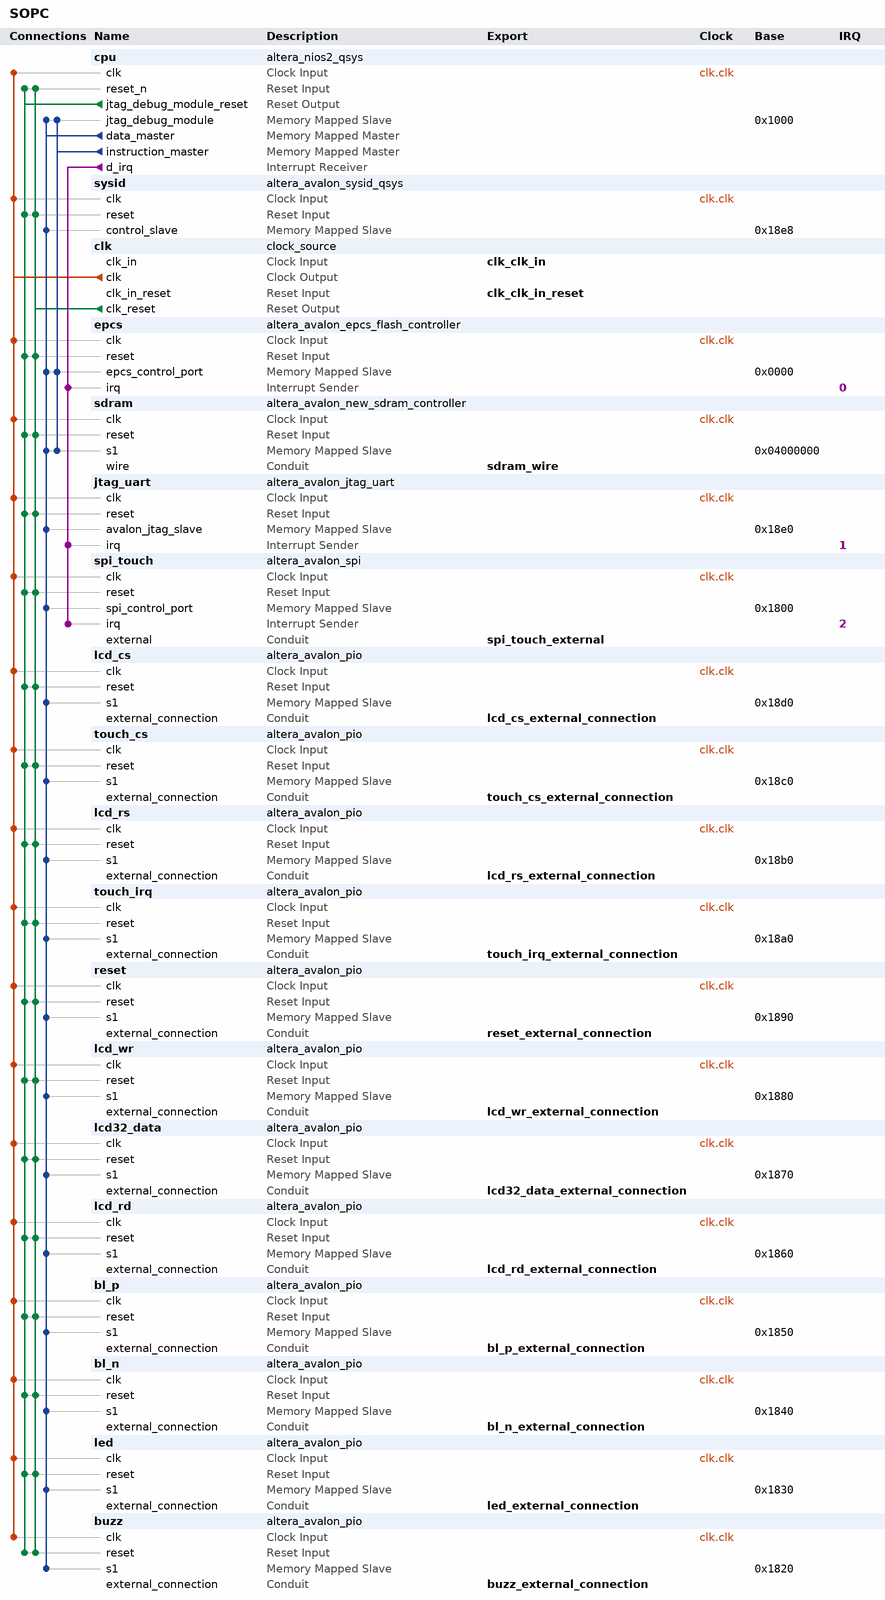
[diagram p0: system contents]
# Platform Designer (Qsys) system SOPC, Cyclone II EP2C5T144C8
# Parameters at their usual value, and those the tool derives, are not listed.
package require -exact qsys 13.0.1.99.2
create_system SOPC
set_project_property DEVICE_FAMILY {Cyclone II}
set_project_property DEVICE EP2C5T144C8

add_instance cpu altera_nios2_qsys 13.0
set_instance_parameter_value cpu manuallyAssignCpuID false
set_instance_parameter_value cpu resetSlave epcs.epcs_control_port
set_instance_parameter_value cpu exceptionSlave sdram.s1
set_instance_parameter_value cpu breakSlave cpu.jtag_debug_module
set_instance_parameter_value cpu impl Fast
set_instance_parameter_value cpu icache_size 2048
set_instance_parameter_value cpu dcache_size 0

add_instance sysid altera_avalon_sysid_qsys 13.0
set_instance_parameter_value sysid id 0

add_instance clk clock_source 13.0
set_instance_parameter_value clk clockFrequency 50000000

add_instance epcs altera_avalon_epcs_flash_controller 13.0.1.99.2
set_instance_parameter_value epcs useASMIAtom true

add_instance sdram altera_avalon_new_sdram_controller 13.0.1.99.2
set_instance_parameter_value sdram TAC 5.5
set_instance_parameter_value sdram TRCD 20.0
set_instance_parameter_value sdram TRP 20.0
set_instance_parameter_value sdram casLatency 3
set_instance_parameter_value sdram columnWidth 9
set_instance_parameter_value sdram dataWidth 16
set_instance_parameter_value sdram generateSimulationModel false
set_instance_parameter_value sdram model custom
set_instance_parameter_value sdram numberOfBanks 4
set_instance_parameter_value sdram numberOfChipSelects 1
set_instance_parameter_value sdram powerUpDelay 100.0
set_instance_parameter_value sdram refreshPeriod 15.625
set_instance_parameter_value sdram rowWidth 13

add_instance jtag_uart altera_avalon_jtag_uart 13.0.1.99.2
set_instance_parameter_value jtag_uart simInteractiveOptions INTERACTIVE_ASCII_OUTPUT

add_instance spi_touch altera_avalon_spi 13.0.1.99.2
set_instance_parameter_value spi_touch clockPolarity 0
set_instance_parameter_value spi_touch dataWidth 8
set_instance_parameter_value spi_touch masterSPI true
set_instance_parameter_value spi_touch numberOfSlaves 1
set_instance_parameter_value spi_touch targetClockRate 1000000

add_instance lcd_cs altera_avalon_pio 13.0.1.99.2
set_instance_parameter_value lcd_cs direction Output
set_instance_parameter_value lcd_cs width 1

add_instance touch_cs altera_avalon_pio 13.0.1.99.2
set_instance_parameter_value touch_cs direction Output
set_instance_parameter_value touch_cs width 1

add_instance lcd_rs altera_avalon_pio 13.0.1.99.2
set_instance_parameter_value lcd_rs direction Output
set_instance_parameter_value lcd_rs width 1

add_instance touch_irq altera_avalon_pio 13.0.1.99.2
set_instance_parameter_value touch_irq direction Input
set_instance_parameter_value touch_irq width 1

add_instance reset altera_avalon_pio 13.0.1.99.2
set_instance_parameter_value reset direction Output
set_instance_parameter_value reset width 1

add_instance lcd_wr altera_avalon_pio 13.0.1.99.2
set_instance_parameter_value lcd_wr direction Output
set_instance_parameter_value lcd_wr width 1

add_instance lcd32_data altera_avalon_pio 13.0.1.99.2
set_instance_parameter_value lcd32_data direction Bidir
set_instance_parameter_value lcd32_data width 16

add_instance lcd_rd altera_avalon_pio 13.0.1.99.2
set_instance_parameter_value lcd_rd direction Output
set_instance_parameter_value lcd_rd width 1

add_instance bl_p altera_avalon_pio 13.0.1.99.2
set_instance_parameter_value bl_p direction Output
set_instance_parameter_value bl_p width 1

add_instance bl_n altera_avalon_pio 13.0.1.99.2
set_instance_parameter_value bl_n direction Output
set_instance_parameter_value bl_n width 1

add_instance led altera_avalon_pio 13.0.1.99.2
set_instance_parameter_value led direction Output
set_instance_parameter_value led width 4

add_instance buzz altera_avalon_pio 13.0.1.99.2
set_instance_parameter_value buzz direction Output
set_instance_parameter_value buzz resetValue 1
set_instance_parameter_value buzz width 4

# connections
add_connection clk.clk bl_n.clk clock
add_connection clk.clk bl_p.clk clock
add_connection clk.clk buzz.clk clock
add_connection clk.clk cpu.clk clock
add_connection clk.clk epcs.clk clock
add_connection clk.clk jtag_uart.clk clock
add_connection clk.clk lcd32_data.clk clock
add_connection clk.clk lcd_cs.clk clock
add_connection clk.clk lcd_rd.clk clock
add_connection clk.clk lcd_rs.clk clock
add_connection clk.clk lcd_wr.clk clock
add_connection clk.clk led.clk clock
add_connection clk.clk reset.clk clock
add_connection clk.clk sdram.clk clock
add_connection clk.clk spi_touch.clk clock
add_connection clk.clk sysid.clk clock
add_connection clk.clk touch_cs.clk clock
add_connection clk.clk touch_irq.clk clock
add_connection clk.clk_reset bl_n.reset reset
add_connection clk.clk_reset bl_p.reset reset
add_connection clk.clk_reset buzz.reset reset
add_connection clk.clk_reset cpu.reset_n reset
add_connection clk.clk_reset epcs.reset reset
add_connection clk.clk_reset jtag_uart.reset reset
add_connection clk.clk_reset lcd32_data.reset reset
add_connection clk.clk_reset lcd_cs.reset reset
add_connection clk.clk_reset lcd_rd.reset reset
add_connection clk.clk_reset lcd_rs.reset reset
add_connection clk.clk_reset lcd_wr.reset reset
add_connection clk.clk_reset led.reset reset
add_connection clk.clk_reset reset.reset reset
add_connection clk.clk_reset sdram.reset reset
add_connection clk.clk_reset spi_touch.reset reset
add_connection clk.clk_reset sysid.reset reset
add_connection clk.clk_reset touch_cs.reset reset
add_connection clk.clk_reset touch_irq.reset reset
add_connection cpu.jtag_debug_module_reset bl_n.reset reset
add_connection cpu.jtag_debug_module_reset bl_p.reset reset
add_connection cpu.jtag_debug_module_reset buzz.reset reset
add_connection cpu.jtag_debug_module_reset cpu.reset_n reset
add_connection cpu.jtag_debug_module_reset epcs.reset reset
add_connection cpu.jtag_debug_module_reset jtag_uart.reset reset
add_connection cpu.jtag_debug_module_reset lcd32_data.reset reset
add_connection cpu.jtag_debug_module_reset lcd_cs.reset reset
add_connection cpu.jtag_debug_module_reset lcd_rd.reset reset
add_connection cpu.jtag_debug_module_reset lcd_rs.reset reset
add_connection cpu.jtag_debug_module_reset lcd_wr.reset reset
add_connection cpu.jtag_debug_module_reset led.reset reset
add_connection cpu.jtag_debug_module_reset reset.reset reset
add_connection cpu.jtag_debug_module_reset sdram.reset reset
add_connection cpu.jtag_debug_module_reset spi_touch.reset reset
add_connection cpu.jtag_debug_module_reset sysid.reset reset
add_connection cpu.jtag_debug_module_reset touch_cs.reset reset
add_connection cpu.jtag_debug_module_reset touch_irq.reset reset
add_connection cpu.data_master bl_n.s1 avalon
set_connection_parameter_value cpu.data_master/bl_n.s1 baseAddress 0x1840
add_connection cpu.data_master bl_p.s1 avalon
set_connection_parameter_value cpu.data_master/bl_p.s1 baseAddress 0x1850
add_connection cpu.data_master buzz.s1 avalon
set_connection_parameter_value cpu.data_master/buzz.s1 baseAddress 0x1820
add_connection cpu.data_master cpu.jtag_debug_module avalon
set_connection_parameter_value cpu.data_master/cpu.jtag_debug_module baseAddress 0x1000
add_connection cpu.data_master epcs.epcs_control_port avalon
set_connection_parameter_value cpu.data_master/epcs.epcs_control_port baseAddress 0x0000
add_connection cpu.data_master jtag_uart.avalon_jtag_slave avalon
set_connection_parameter_value cpu.data_master/jtag_uart.avalon_jtag_slave baseAddress 0x18e0
add_connection cpu.data_master lcd32_data.s1 avalon
set_connection_parameter_value cpu.data_master/lcd32_data.s1 baseAddress 0x1870
add_connection cpu.data_master lcd_cs.s1 avalon
set_connection_parameter_value cpu.data_master/lcd_cs.s1 baseAddress 0x18d0
add_connection cpu.data_master lcd_rd.s1 avalon
set_connection_parameter_value cpu.data_master/lcd_rd.s1 baseAddress 0x1860
add_connection cpu.data_master lcd_rs.s1 avalon
set_connection_parameter_value cpu.data_master/lcd_rs.s1 baseAddress 0x18b0
add_connection cpu.data_master lcd_wr.s1 avalon
set_connection_parameter_value cpu.data_master/lcd_wr.s1 baseAddress 0x1880
add_connection cpu.data_master led.s1 avalon
set_connection_parameter_value cpu.data_master/led.s1 baseAddress 0x1830
add_connection cpu.data_master reset.s1 avalon
set_connection_parameter_value cpu.data_master/reset.s1 baseAddress 0x1890
add_connection cpu.data_master sdram.s1 avalon
set_connection_parameter_value cpu.data_master/sdram.s1 baseAddress 0x04000000
add_connection cpu.data_master spi_touch.spi_control_port avalon
set_connection_parameter_value cpu.data_master/spi_touch.spi_control_port baseAddress 0x1800
add_connection cpu.data_master sysid.control_slave avalon
set_connection_parameter_value cpu.data_master/sysid.control_slave baseAddress 0x18e8
add_connection cpu.data_master touch_cs.s1 avalon
set_connection_parameter_value cpu.data_master/touch_cs.s1 baseAddress 0x18c0
add_connection cpu.data_master touch_irq.s1 avalon
set_connection_parameter_value cpu.data_master/touch_irq.s1 baseAddress 0x18a0
add_connection cpu.instruction_master cpu.jtag_debug_module avalon
set_connection_parameter_value cpu.instruction_master/cpu.jtag_debug_module baseAddress 0x1000
add_connection cpu.instruction_master epcs.epcs_control_port avalon
set_connection_parameter_value cpu.instruction_master/epcs.epcs_control_port baseAddress 0x0000
add_connection cpu.instruction_master sdram.s1 avalon
set_connection_parameter_value cpu.instruction_master/sdram.s1 baseAddress 0x04000000
add_connection cpu.d_irq epcs.irq interrupt
set_connection_parameter_value cpu.d_irq/epcs.irq irqNumber 0
add_connection cpu.d_irq jtag_uart.irq interrupt
set_connection_parameter_value cpu.d_irq/jtag_uart.irq irqNumber 1
add_connection cpu.d_irq spi_touch.irq interrupt
set_connection_parameter_value cpu.d_irq/spi_touch.irq irqNumber 2

# exported interfaces
add_interface clk_clk_in_reset reset sink
set_interface_property clk_clk_in_reset EXPORT_OF clk.clk_in_reset
add_interface clk_clk_in clock sink
set_interface_property clk_clk_in EXPORT_OF clk.clk_in
add_interface sdram_wire conduit end
set_interface_property sdram_wire EXPORT_OF sdram.wire
add_interface spi_touch_external conduit end
set_interface_property spi_touch_external EXPORT_OF spi_touch.external
add_interface lcd_cs_external_connection conduit end
set_interface_property lcd_cs_external_connection EXPORT_OF lcd_cs.external_connection
add_interface touch_cs_external_connection conduit end
set_interface_property touch_cs_external_connection EXPORT_OF touch_cs.external_connection
add_interface lcd_rs_external_connection conduit end
set_interface_property lcd_rs_external_connection EXPORT_OF lcd_rs.external_connection
add_interface touch_irq_external_connection conduit end
set_interface_property touch_irq_external_connection EXPORT_OF touch_irq.external_connection
add_interface reset_external_connection conduit end
set_interface_property reset_external_connection EXPORT_OF reset.external_connection
add_interface lcd_wr_external_connection conduit end
set_interface_property lcd_wr_external_connection EXPORT_OF lcd_wr.external_connection
add_interface lcd32_data_external_connection conduit end
set_interface_property lcd32_data_external_connection EXPORT_OF lcd32_data.external_connection
add_interface lcd_rd_external_connection conduit end
set_interface_property lcd_rd_external_connection EXPORT_OF lcd_rd.external_connection
add_interface bl_p_external_connection conduit end
set_interface_property bl_p_external_connection EXPORT_OF bl_p.external_connection
add_interface bl_n_external_connection conduit end
set_interface_property bl_n_external_connection EXPORT_OF bl_n.external_connection
add_interface led_external_connection conduit end
set_interface_property led_external_connection EXPORT_OF led.external_connection
add_interface buzz_external_connection conduit end
set_interface_property buzz_external_connection EXPORT_OF buzz.external_connection

set_interconnect_requirement {$system} qsys_mm.clockCrossingAdapter HANDSHAKE
set_interconnect_requirement {$system} qsys_mm.maxAdditionalLatency 0

save_system SOPC.qsys
